# EAGLE design 1u_panel (EAGLE 7.7.0)
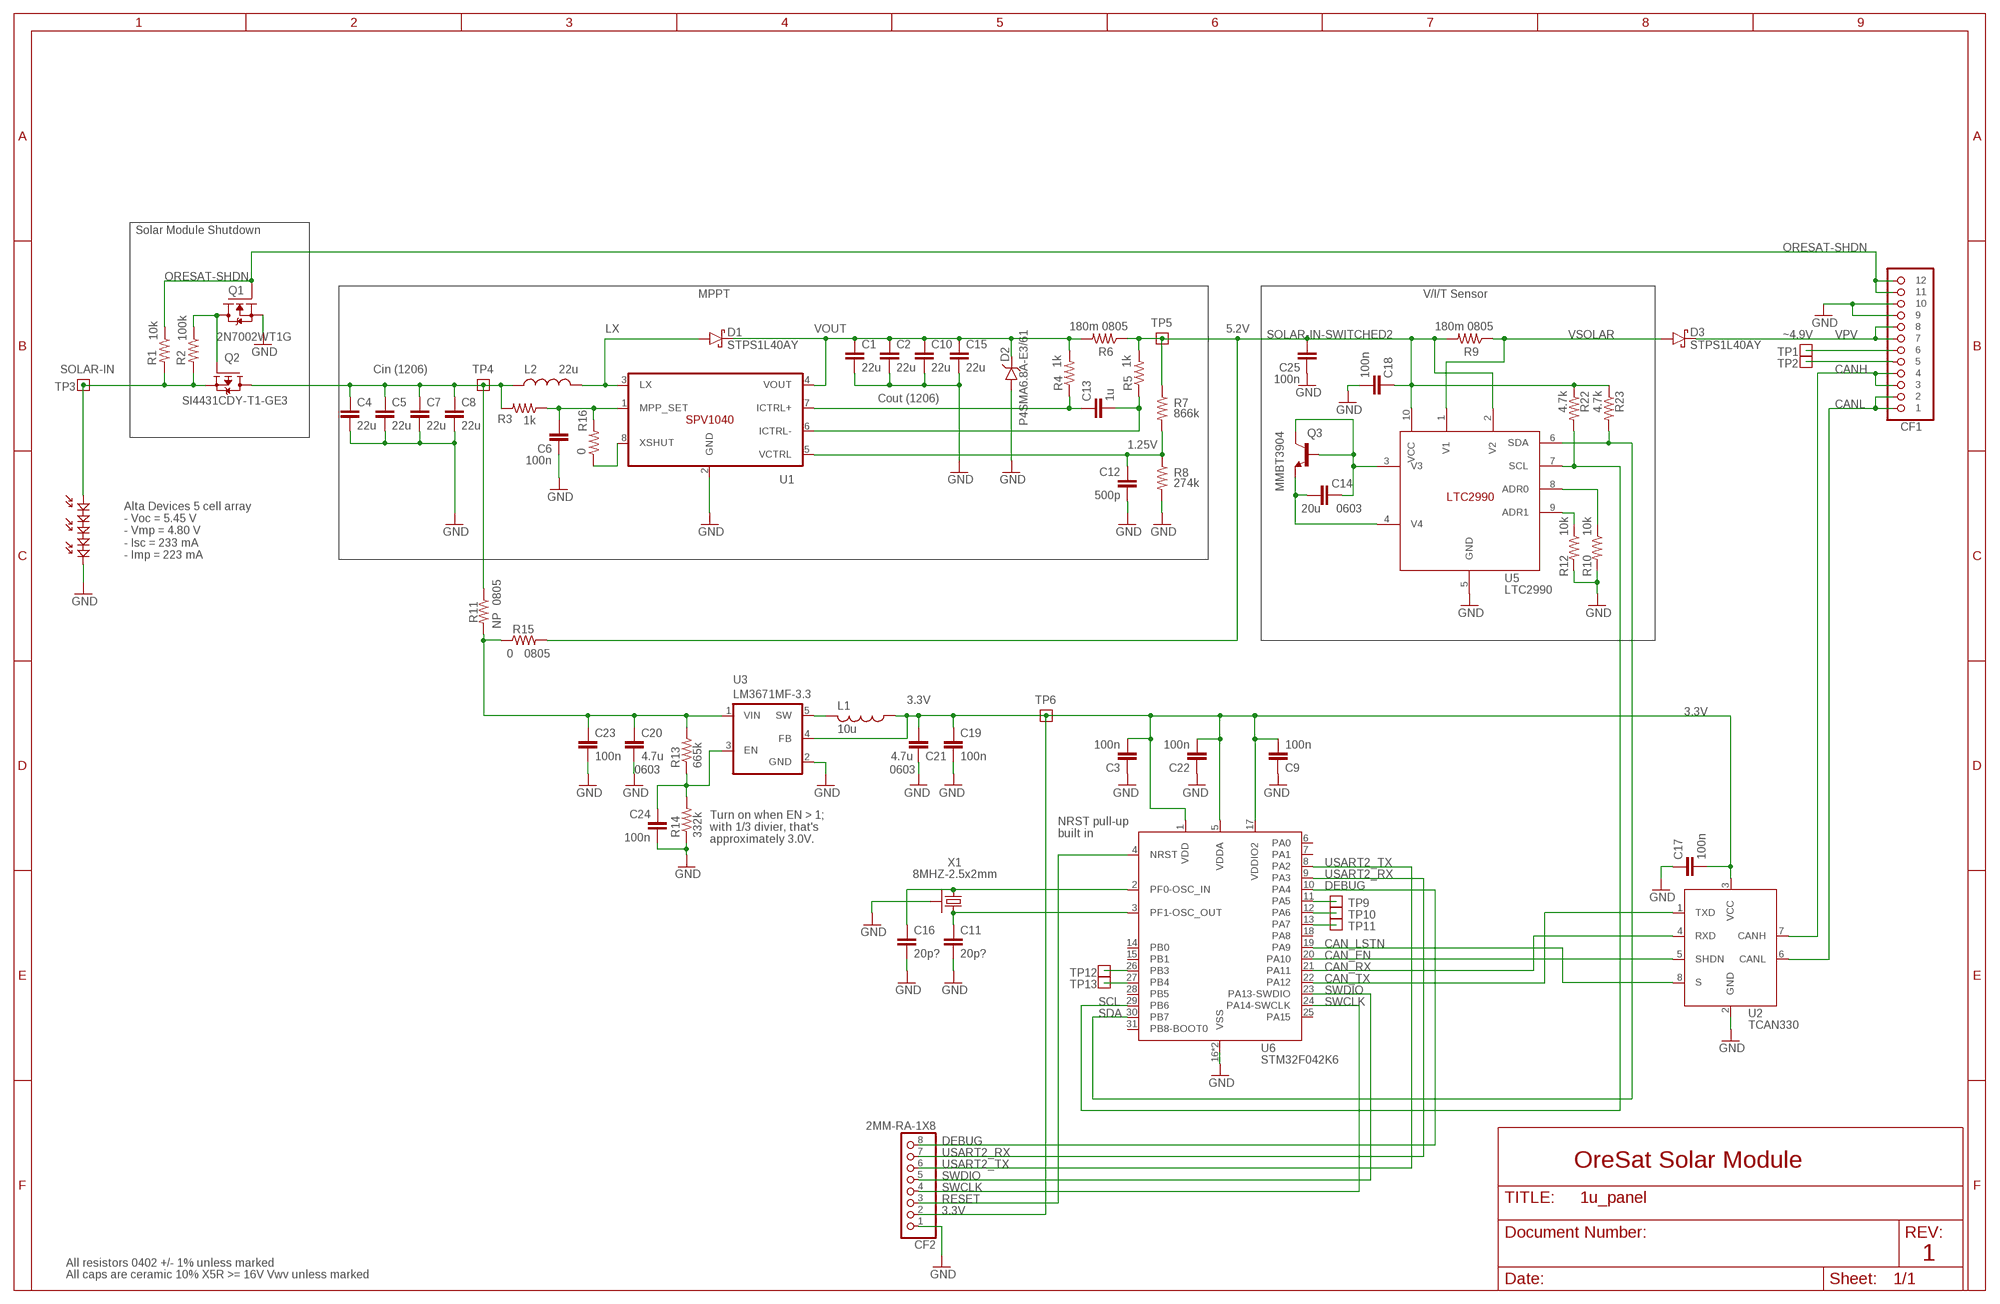
[diagram p0: schematic, sheet 1]

## Parts
C1  22u  C-EU1206-B  [1206-B]
C2  22u  C-EU1206-B  [1206-B]
C3  100n  C-EU0402-B-NOSILK  [.0402-B-NOSILK]
C4  22u  C-EU1206-B  [1206-B]
C5  22u  C-EU1206-B  [1206-B]
C6  100n  C-EU0402-B-NOSILK  [.0402-B-NOSILK]
C7  22u  C-EU1206-B  [1206-B]
C8  22u  C-EU1206-B  [1206-B]
C9  100n  C-EU0402-B-NOSILK  [.0402-B-NOSILK]
C10  22u  C-EU1206-B  [1206-B]
C11  20p?  C-EU0402-B-NOSILK  [.0402-B-NOSILK]
C12  500p  C-EU0402-B-NOSILK  [.0402-B-NOSILK]
C13  1u  C-EU0402-B-NOSILK  [.0402-B-NOSILK]
C14  20u  C-EU0603-B-NOSILK  [.0603-B-NOSILK]
C15  22u  C-EU1206-B  [1206-B]
C16  20p?  C-EU0402-B-NOSILK  [.0402-B-NOSILK]
C17  100n  C-EU0402-B-NOSILK  [.0402-B-NOSILK]
C18  100n  C-EU0402-B-NOSILK  [.0402-B-NOSILK]
C19  100n  C-EU0402-B-NOSILK  [.0402-B-NOSILK]
C20  4.7u  C-EUC0603  [C0603]
C21  4.7u  C-EUC0603  [C0603]
C22  100n  C-EU0402-B-NOSILK  [.0402-B-NOSILK]
C23  100n  C-EU0402-B-NOSILK  [.0402-B-NOSILK]
C24  100n  C-EU0402-B-NOSILK  [.0402-B-NOSILK]
C25  100n  C-EU0402-B-NOSILK  [.0402-B-NOSILK]
CF1  ORESAT-SOLARPANEL-12PIN  [CON-1.27-F-HARTING-1522012X601XXX]
CF2  2MM-RA-1X8  [CF-2MM-RA-1X8-PRECIDIP-831]
D1  STPS1L40AY  DIODE-DO214AC  [DO214AC]
D2  P4SMA6.8A-E3/61  DIODE-DO214AC  [DO214AC]
D3  STPS1L40AY  DIODE-DO214AC  [DO214AC]
L1  10u  L-USL2012C  [L2012C]
L2  22u  L-VISHAY-DALE-IFSC-1515AHER  [VISHAY-DALE-IFSR-1515AHER]
PV1  ALTA-5-CELL-ARRAYALTA-FIVE-CELL-SLOT  [ALTA-FIVE-CELL-THROUGH-SLOT]
Q1  2N7002WT1G  ON-N-CHANNEL-FET  [SOT23]
Q2  SI4431CDY-T1-GE3  P-CHANNELFET  [SO8]
Q3  MMBT3904  DIODE-INC-NPNSOT23HOLE  [SOT23HOLE]
R1  10k  R-US_0402-B-NOSILK  [.0402-B-NOSILK]
R2  100k  R-US_0402-B-NOSILK  [.0402-B-NOSILK]
R3  1k  R-US_0402-B-NOSILK  [.0402-B-NOSILK]
R4  1k  R-US_0402-B-NOSILK  [.0402-B-NOSILK]
R5  1k  R-US_0402-B-NOSILK  [.0402-B-NOSILK]
R6  180m 0805  R-US_0805-B-NOSILK  [.0805-B-NOSILK]
R7  866k  R-US_0402-B-NOSILK  [.0402-B-NOSILK]
R8  274k  R-US_0402-B-NOSILK  [.0402-B-NOSILK]
R9  180m 0805  R-US_0805-B-NOSILK  [.0805-B-NOSILK]
R10  10k  R-US_0402-B-NOSILK  [.0402-B-NOSILK]
R11  NP  R-US_0805-B-NOSILK  [.0805-B-NOSILK]
R12  10k  R-US_0402-B-NOSILK  [.0402-B-NOSILK]
R13  665k  R-US_0402-B-NOSILK  [.0402-B-NOSILK]
R14  332k  R-US_0402-B-NOSILK  [.0402-B-NOSILK]
R15  0  R-US_0805-B-NOSILK  [.0805-B-NOSILK]
R16  0  R-US_0402-B-NOSILK  [.0402-B-NOSILK]
R22  4.7k  R-US_0402-B-NOSILK  [.0402-B-NOSILK]
R23  4.7k  R-US_0402-B-NOSILK  [.0402-B-NOSILK]
TP1  TEST-POINT  [2MM-TEST-POINT]
TP2  TEST-POINT  [2MM-TEST-POINT]
TP3  TEST-POINT  [2MM-TEST-POINT]
TP4  TEST-POINT  [2MM-TEST-POINT]
TP5  TEST-POINT  [2MM-TEST-POINT]
TP6  TEST-POINT  [2MM-TEST-POINT]
TP9  TEST-POINT  [2MM-TEST-POINT]
TP10  TEST-POINT  [2MM-TEST-POINT]
TP11  TEST-POINT  [2MM-TEST-POINT]
TP12  TEST-POINT  [2MM-TEST-POINT]
TP13  TEST-POINT  [2MM-TEST-POINT]
U1  SPV1040  [TSSOP-8]
U2  TCAN330  [SOT23-8_TI-DCN]
U3  LM3671MF-3.3  LM3761  [SOT23-5]
U5  LTC2990  [MSOP10]
U6  STM32F042K6  [QFP32-7X7]
X1  8MHZ-2.5x2mm  CRYSTAL-WITH-GND  [CRYSTAL_2.5X2]

## Nets
3.3V: C3.2 C9.2 C17.2 C19.1 C21.1 C22.2 CF2.2 L1.1 TP6.1 U2.3(VCC) U3.4(FB) U6.1(VDD) U6.5(VDDA) U6.17(VDDIO2)
ADDRSELECT: R10.1 U5.8(ADR0)
ADR1: R12.1 U5.9(ADR1)
CAN_EN: U2.5(SHDN) U6.20(PA10)
CAN_LSTN: U2.8(S) U6.19(PA9)
CAN_RX: U2.4(RXD) U6.21(PA11)
CAN_TX: U2.1(TXD) U6.22(PA12)
CANH: CF1.3 CF1.4 U2.7(CANH)
CANL: CF1.1 CF1.2 U2.6(CANL)
CRYSTALIN: C16.1 U6.2(PF0-OSC_IN) X1.1
CRYSTALOUT: C11.1 U6.3(PF1-OSC_OUT) X1.3
DEBUG: CF2.8 U6.10(PA4)
GND: C1.2 C2.2 C3.1 C4.2 C5.2 C6.1 C7.2 C8.2 C9.1 C10.2 C11.2 C12.2 C15.2 C16.2 C17.1 C18.2 C19.2 C20.2 C21.2 C22.1 C23.2 C24.2 C25.1 CF1.9 CF1.10 CF2.1 D2.A PV1.NEG1(NEG) PV1.NEG2(NEG) Q1.2(S) R8.2 R10.2 R12.2 R14.1 U1.2(GND) U2.2(GND) U3.2(GND) U5.5(GND) U6.16(VSS) U6.32(VSS) X1.2(SHIELD) X1.4(SHIELD)
ICTRL+: C13.2 R4.1 U1.7(ICTRL+)
ICTRL-: C13.1 R5.1 U1.6(ICTRL-)
LX: D1.A L2.1 U1.3(LX)
MPP-SET: C6.2 R3.1 R16.2 U1.1(MPP_SET)
N6: Q1.3(D) Q2.4(G) R2.1
N$1: C20.1 C23.1 R11.2 R13.2 R15.1 U3.1(VIN)
N$3: CF1.6 TP1.1
N$4: CF1.5 TP2.1
N$6: TP9.1 U6.11(PA5)
N$7: TP10.1 U6.12(PA6)
N$8: TP11.1 U6.13(PA7)
N$9: TP12.1 U6.26(PB3)
N$10: TP13.1 U6.27(PB4)
ORESAT-SHDN: CF1.11 CF1.12 Q1.1(G) R1.1
RESET: CF2.3 U6.4(NRST)
SCL: R22.2 U5.7(SCL) U6.29(PB6)
SDA: R23.2 U5.6(SDA) U6.30(PB7)
SOLAR-IN: PV1.POS1(POS) PV1.POS2(POS) Q2.1(S) Q2.2(S) Q2.3(S) R1.2 R2.2 TP3.1
SOLAR-IN-SWITCHED: C4.1 C5.1 C7.1 C8.1 L2.2 Q2.5(D) Q2.6(D) Q2.7(D) Q2.8(D) R3.2 R11.1 TP4.1
SOLAR-IN-SWITCHED2: C18.1 C25.2 R5.2 R6.1 R7.1 R9.2 R15.2 R22.1 R23.1 TP5.1 U5.2(V2) U5.10(VCC)
STEPD: L1.2 U3.5(SW)
SWCLK: CF2.4 U6.24(PA14-SWCLK)
SWDIO: CF2.5 U6.23(PA13-SWDIO)
USART2_RX: CF2.7 U6.9(PA3)
USART2_TX: CF2.6 U6.8(PA2)
V3: C14.2 Q3.1(B) Q3.3(C) U5.3(V3)
V4: C14.1 Q3.2(E) U5.4(V4)
VCTRL: C12.1 R7.2 R8.1 U1.5(VCTRL)
VDIV: C24.1 R13.1 R14.2 U3.3(EN)
VOUT: C1.1 C2.1 C10.1 C15.1 D1.C D2.C R4.2 R6.2 U1.4(VOUT)
VPV: CF1.7 CF1.8 D3.C
VSOLAR: D3.A R9.1 U5.1(V1)
XSHUT: R16.1 U1.8(XSHUT)
Unconnected: U6.6(PA0) U6.7(PA1) U6.14(PB0) U6.15(PB1) U6.18(PA8) U6.25(PA15) U6.28(PB5) U6.31(PB8-BOOT0)

## Notes on the sheet
- Solar Module Shutdown
- MPPT | V/I/T Sensor
- 5.2V
- ~4.9V
- Cin (1206)
- Cout (1206)
- 1.25V
- 0603
- Alta Devices 5 cell array
  - Voc = 5.45 V
  - Vmp = 4.80 V
  - Isc = 233 mA
  - Imp = 223 mA
- 0805
- 0805
- 0603 | 0603
- NRST pull-up
  built in
- Turn on when EN > 1; 
  with 1/3 divier, that's
  approximately 3.0V.
- OreSat Solar Module
- 1
- All resistors 0402 +/- 1% unless marked
- All caps are ceramic 10% X5R >= 16V Vwv unless marked

## Library data of the parts
C1 C2 C4 C5 C7 C8 C10 C15 = rcl_custom:C-EU: CAPACITOR, European symbol; DIS: Digi-Key; DPN: 490-5309-1-ND; MFR: Murata; MPN: GRM31CR71A226KE15L
C3 C6 C9 C17-C19 C22-C25 = rcl_custom:C-EU: CAPACITOR, European symbol; DIS: Digi-key; DPN: 1276-1001-1-ND; MFR: Samsung Electro-Mechanics America, Inc.; MPN: CL05B104KO5NNNC
C11 C16 = rcl_custom:C-EU: CAPACITOR, European symbol
C12 = rcl_custom:C-EU: CAPACITOR, European symbol; DIS: Digi-key; DPN: 1276-1577-1-ND; MFR: Samsung Electro-Mechanics America, Inc.; MPN: CL05B561KB5NNNC
C13 = rcl_custom:C-EU: CAPACITOR, European symbol; DIS: Digi-key; DPN: 1276-1445-1-ND; MFR: Samsung Electro-Mechanics America, Inc.; MPN: CL05A105KA5NQNC
C14 = rcl_custom:C-EU: CAPACITOR, European symbol; DIS: Digi-key; DPN: 1276-1274-1-ND; MFR: Samsung Electro-Mechanics America, Inc.; MPN: CL10A226MP8NUNE
C20 C21 = rcl:C-EU: CAPACITOR, European symbol; DIS: Digi-key; DPN: 1276-1001-1-ND; MFR: Samsung Electro-Mechanics America, Inc.; MPN: CL05B104KO5NNNC
CF1 = oresat-eagle:ORESAT-SOLARPANEL-12PIN
CF2 = 2mm-RA-solar-module-debugging:2MM-RA-1X8; DIST: Digi-Key; DPN: 1212-1893-ND; MFN: PreciDip; MPN: 831-87-050-40-001101
D1 D3 = diode-schottkey:DIODE-: DIODE; DIST: Digi-Key; DPN: 497-12286-1-ND; MFR: ST; MPN: STPS1L40AY
D2 = diode-zener-tvs:DIODE-: DIODE; DIST: Digi-Key; DPN: P4SMA6.8A-E3/61GICT-ND; MFR: Vishay; MPN: P4SMA6.8A-E3/61
L1 = rcl:L-US: INDUCTOR, American symbol; DIS: Digi-key; DPN: 587-2452-1-ND; MFR: Taiyo Yuden; MPN: CB2012T100KR
L2 = ind-vishay-dale-IFSC-1515AHER:L-VISHAY-DALE-IFSC-1515AHER; DIS: Digi-Key; DPN: 541-1407-1-ND; MFR: Vishay Dale; MPN: IFSC1515AHER220M01
PV1 = alta-cell:ALTA-5-CELL-ARRAY
Q1 = on-n-channel-fet:ON-N-CHANNEL-FET; DIS: Digi-Key; DPN: 2N7002WT1GOSCT-ND; MFR: rer ON Semiconductor; MPN: 2N7002WT1G
Q2 = vishay-p-channel-fet:P-CHANNELFET; DIS: Digi-key; DPN: SI4431CDY-T1-GE3CT-ND; MFR: Vishay Siliconix; MPN: SI4431CDY-T1-GE3
Q3 = diodes-inc-npn:DIODE-INC-NPN; DIS: Digi-Key; DPN: MMBT3904FSCT-ND; MFR: Fairchild/ON Semiconductor; MPN: MMBT3904
R1 = rcl_custom:R-US_: RESISTOR, American symbol; DIS: Digi-Key; DPN: RHM10.0KLCT-ND; MFR: Rohm Semiconductor; MPN: MCR01MZPF1002
R2 = rcl_custom:R-US_: RESISTOR, American symbol; DIS: Digi-key; DPN: RHM100KCDCT-ND; MFR: Rohm Semiconductor; MPN: MCR01MRTF1003
R3 = rcl_custom:R-US_: RESISTOR, American symbol; DIS: Digi-key; DPN: RHM1.00KLCT-ND; MFN: Rohm Semiconductor; MPN: MCR01MZPF1001
R4 R5 R11 R15 R16 = rcl_custom:R-US_: RESISTOR, American symbol
R6 R9 = rcl_custom:R-US_: RESISTOR, American symbol; DIST: Digi-Key; DPN: 541-2730-1-ND; MFR: Vishay Dale; MPN: RCWE0805R180FKEA
R7 = rcl_custom:R-US_: RESISTOR, American symbol; DIS: Digi-key; DPN: 1276-4285-1-ND; MFN: Samsung Electro-Mechanics America, Inc.; MPN: RC1005F8663CS
R8 = rcl_custom:R-US_: RESISTOR, American symbol; DIS: Digi-key; DPN: 541-274KLCT-ND; MFR: Vishay Dale; MPN: CRCW0402274KFKED
R10 R12 = rcl_custom:R-US_: RESISTOR, American symbol; DIS: Digi-key; DPN: RHM10.0KLCT-ND; MFR: Rohm Semiconductor; MPN: MCR01MZPF1002
R13 = rcl_custom:R-US_: RESISTOR, American symbol; DIS: Digi-key; DPN: 1276-4275-1-ND; MFR: Samsung Electro-Mechanics America, Inc.; MPN: RC1005F6653CS
R14 = rcl_custom:R-US_: RESISTOR, American symbol; DIS: Digi-key; DPN: 1276-4245-1-ND; MFR: Samsung Electro-Mechanics America, Inc.; MPN: RC1005F3323CS
R22 R23 = rcl_custom:R-US_: RESISTOR, American symbol; DIS: Digi-key; DPN: RHM4.7KBHCT-ND; MFR: Rohm Semiconductor; MPN: TRR01MZPF4701
TP1-TP6 TP9-TP13 = Tova:TEST-POINT
U1 = spv1040:SPV1040; DIS: Digi-key; DPN: 497-11417-ND; MFR: STMicroelectronics; MPN: SPV1040T
U2 = TCAN330:TCAN330; DIS: Digi-key; DPN: 296-44211-1-ND; MFR: Texas Instruments; MPN: TCAN330GDCNT
U3 = LM3761:LM3761: http://www.digikey.com/product-detail/en/texas-instruments/LM3671MF-3.3-NOPB/LM3671MF-3.3-NOPBCT-ND/1590190
U5 = LTC2990:LTC2990; DIS: Digi-Key; DPN: LTC2990CMS#PBF-ND; MFR: Linear Technology; MPN: LTC2990CMS#PBF
U6 = STM32F042K:STM32F042K6; DIS: Digi-key; DPN: 497-14647-ND; MFR: STMicroelectronics; MPN: STM32F042K6T6
X1 = low-gain-radio:CRYSTAL-WITH-GND; DIS: Digi-key; DPN: XC2015CT-ND; MFR: ECS Inc.; MPN: ECS-80-18-20BQ-DS

## Board
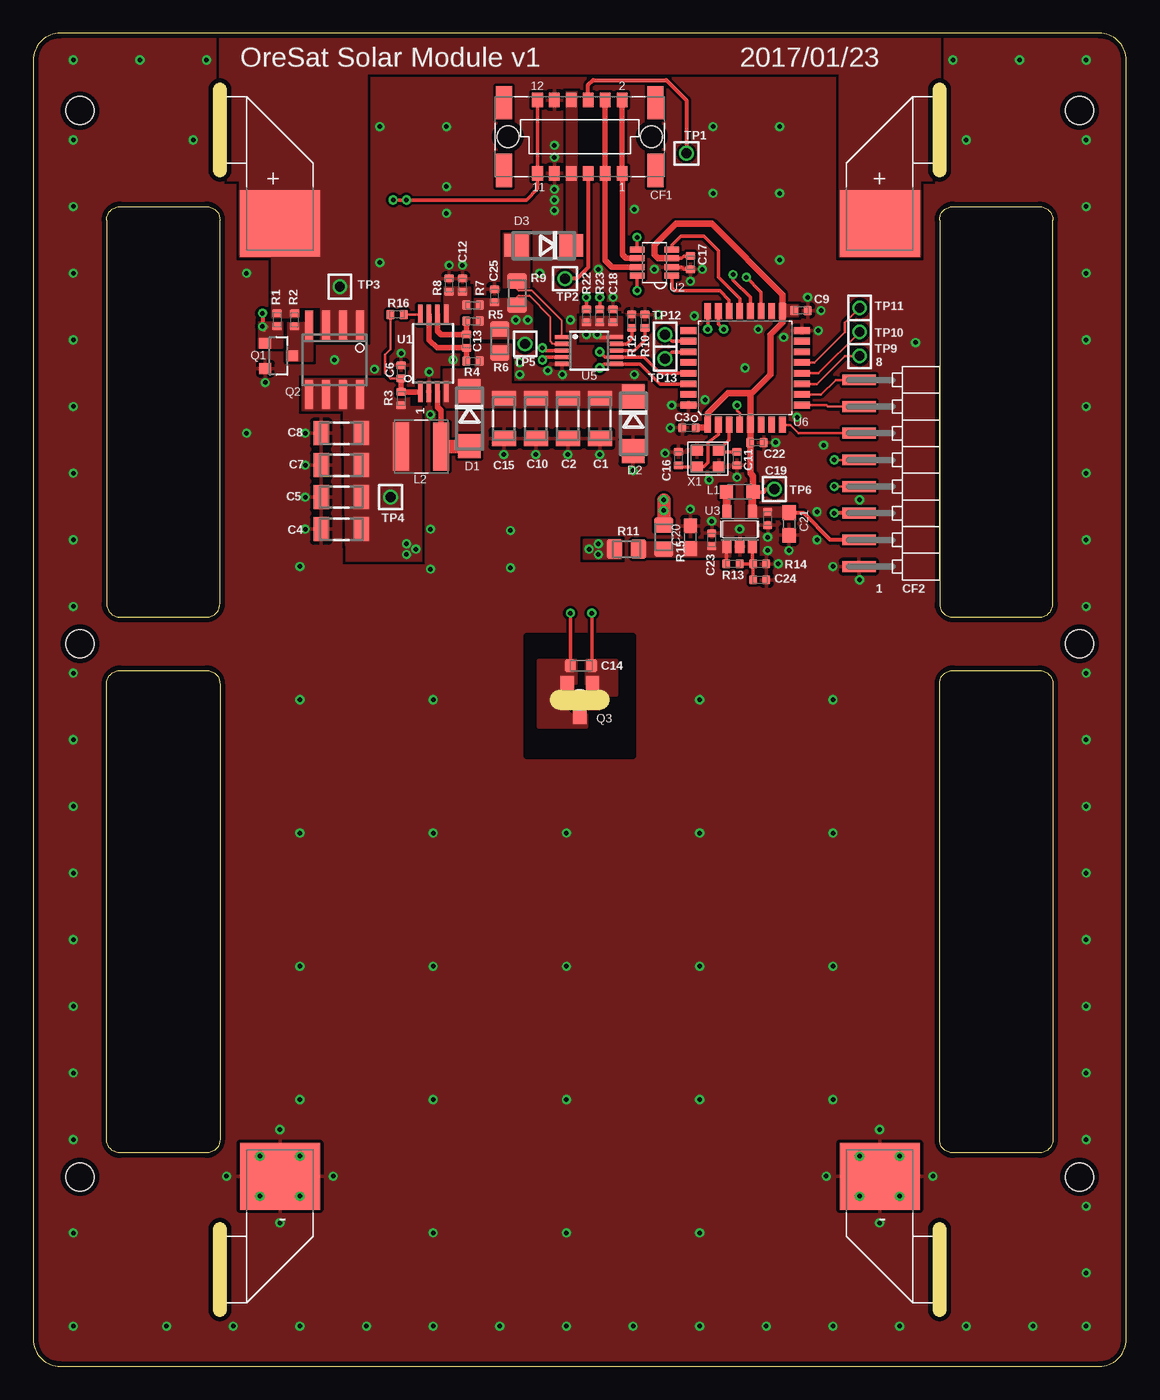
[diagram p1: board, top side]
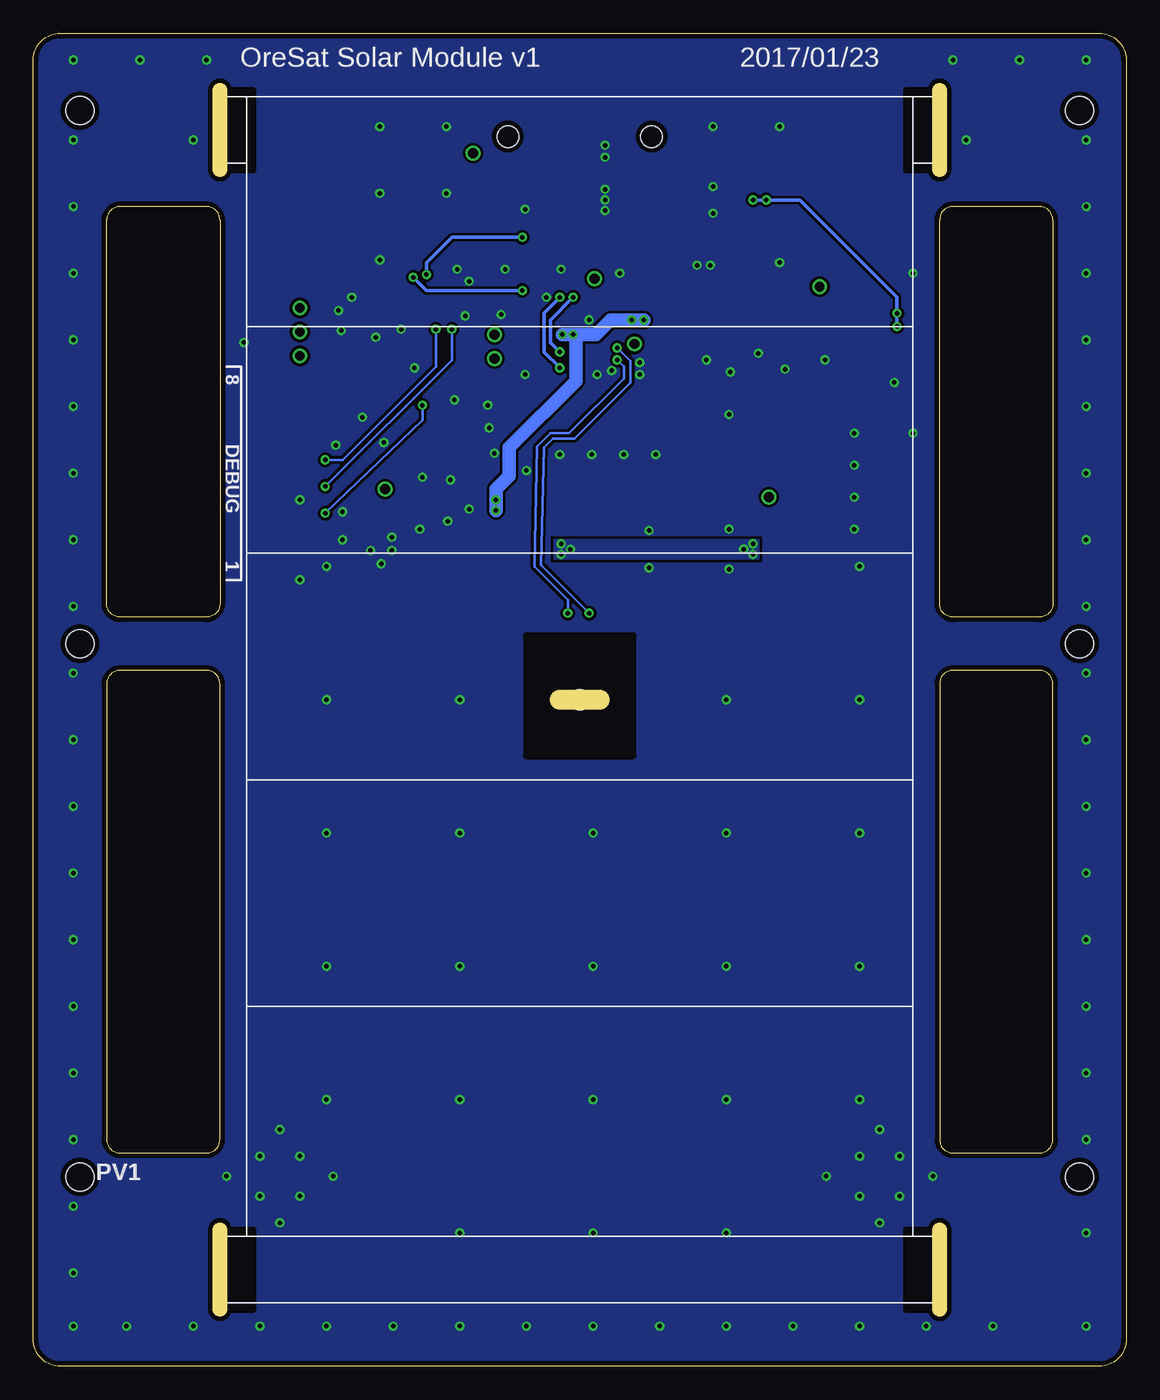
[diagram p2: board, bottom side, seen from below]

Size 82 x 100 mm. Coordinates in mm from the lower left corner, seen from the top.
Outline: 80,100 2,100 arc90 0,98 0,2 arc90 2,0 80,0 arc90 82,2 82,98 arc90 80,100
Outline: 6.5,56.2 13,56.2 arc90 14,57.2 14,86 arc90 13,87 6.5,87 arc90 5.5,86 5.5,57.2 arc90 6.5,56.2
Outline: 5.5,17 5.5,51.2 arc-90 6.5,52.2 13,52.2 arc-90 14,51.2 14,17 arc-90 13,16 6.5,16 arc-90 5.5,17
Outline: 69,56.2 75.5,56.2 arc90 76.5,57.2 76.5,86 arc90 75.5,87 69,87 arc90 68,86 68,57.2 arc90 69,56.2
Outline: 68,17 68,51.2 arc-90 69,52.2 75.5,52.2 arc-90 76.5,51.2 76.5,17 arc-90 75.5,16 69,16 arc-90 68,17
Outline: 68,89.25 arc90 68.5,89.75 68.5,95.75 arc90 68,96.25 arc90 67.5,95.75 67.5,89.75 arc90 68,89.25
Outline: 14.5,89.75 14.5,95.75 arc90 14,96.25 arc90 13.5,95.75 13.5,89.75 arc90 14,89.25 arc90 14.5,89.75
Outline: 14.5,4.25 14.5,10.25 arc90 14,10.75 arc90 13.5,10.25 13.5,4.25 arc90 14,3.75 arc90 14.5,4.25
Outline: 68.5,4.25 68.5,10.25 arc90 68,10.75 arc90 67.5,10.25 67.5,4.25 arc90 68,3.75 arc90 68.5,4.25
Copper layers (1*16): Top 0.0356mm / dielectric 1.5011mm / Bottom 0.0356mm
Design rules "OSH-Park-2-layer *": minimum track width 6mil, minimum drill 13mil, track to track 6mil, track to pad 6mil, pad to pad 6mil, via to via 6mil, smd to smd 6mil, copper to edge 15mil, drill to drill 6mil, minimum pad ring 7mil, minimum via ring 7mil, stop-mask expansion 3mil, vias tented up to drill 13mil, thermal gap 10mil
Holes 2.1 mm at 3.5,14.2 3.5,54.2 3.5,94.2 78.5,14.2 78.5,54.2 78.5,94.2
tKeepout: area 0,0 to 82,100
tRestrict: 6 lines
bRestrict: 4 lines
Milling: 1 lines

### Footprints (pad centres in the part's own frame; a part is rotated, then mirrored left to right if it is on the bottom)
1206-B = smd 1.15 x 1.8: 1 -1.5,0; 2 1.5,0
.0402-B-NOSILK = smd 0.6 x 0.7: 1 -0.5,0; 2 0.5,0
.0603-B-NOSILK = smd 0.8 x 0.95: 1 -0.8,0; 2 0.8,0
C0603 = smd 1.1 x 1: 1 -0.85,0; 2 0.85,0
CON-1.27-F-HARTING-1522012X601XXX = smd 0.8 x 1.1: 1 3.175,-2.75; 2 3.175,2.75; 3 1.905,-2.75; 4 1.905,2.75; 5 0.635,-2.75; 6 0.635,2.75; 7 -0.635,-2.75; 8 -0.635,2.75; 9 -1.905,-2.75; 10 -1.905,2.75; 11 -3.175,-2.75; 12 -3.175,2.75 | smd 1.2 x 2.5: P$1 -5.685,-2.55; P$2 -5.685,2.55; P$3 5.685,2.55; P$4 5.685,-2.55 | hole 1.6: -5.385,0; 5.385,0
CF-2MM-RA-1X8-PRECIDIP-831 = smd 2.5 x 0.8: 1 -3.25,-7; 2 -3.25,-5; 3 -3.25,-3; 4 -3.25,-1; 5 -3.25,1; 6 -3.25,3; 7 -3.25,5; 8 -3.25,7
DO214AC = smd 1.8 x 1.7: A 2.05,0; C -2.05,0
L2012C = smd 1 x 1: 1 -1,0; 2 1,0
VISHAY-DALE-IFSR-1515AHER = smd 3.6 x 1.2: 1 0,1.5; 2 0,-1.5
ALTA-FIVE-CELL-THROUGH-SLOT = smd 6 x 5 bottom: NEG1 -22.5,35.75; NEG2 22.5,35.75; POS1 -22.5,-35.75; POS2 22.5,-35.75
SOT23 = smd 0.8 x 0.9: 1 -0.95,-1; 2 0.95,-1; 3 0,1
SO8 = smd 0.6 x 2.2: 1 -1.905,-2.6; 2 -0.635,-2.6; 3 0.635,-2.6; 4 1.905,-2.6; 5 1.905,2.6; 6 0.635,2.6; 7 -0.635,2.6; 8 -1.905,2.6
SOT23HOLE = smd 1 x 1.4: 1 0.95,-1.1; 2 -0.95,-1.1; 3 0,1.1 | hole 1.5: 0,0
.0805-B-NOSILK = smd 1.15 x 1.45: 1 -0.9,0; 2 0.9,0
2MM-TEST-POINT = drill 0.737: 1 0,0
TSSOP-8 = smd 1.56 x 0.41: 1 -2.88,0.975; 2 -2.88,0.325; 3 -2.88,-0.325; 4 -2.88,-0.975; 5 2.88,-0.975; 6 2.88,-0.325; 7 2.88,0.325; 8 2.88,0.975
SOT23-8_TI-DCN = smd 0.45 x 1.1: 1 -0.975,-1.3; 2 -0.325,-1.3; 3 0.325,-1.3; 4 0.975,-1.3; 5 0.975,1.3; 6 0.325,1.3; 7 -0.325,1.3; 8 -0.975,1.3
SOT23-5 = smd 0.69 x 0.99: 1 -0.95,-1.29; 2 0,-1.29; 3 0.95,-1.29; 4 0.95,1.3; 5 -0.95,1.3
MSOP10 = smd 0.3 x 1: 1 -1,-2.05; 2 -0.5,-2.05; 3 0,-2.05; 4 0.5,-2.05; 5 1,-2.05; 6 1,2.05; 7 0.5,2.05; 8 0,2.05; 9 -0.5,2.05; 10 -1,2.05
QFP32-7X7 = smd 1.2 x 0.5: 1 -4.25,2.8; 2 -4.25,2; 3 -4.25,1.2; 4 -4.25,0.4; 5 -4.25,-0.4; 6 -4.25,-1.2; 7 -4.25,-2; 8 -4.25,-2.8; 17 4.25,-2.8; 18 4.25,-2; 19 4.25,-1.2; 20 4.25,-0.4; 21 4.25,0.4; 22 4.25,1.2; 23 4.25,2; 24 4.25,2.8 | smd 0.5 x 1.2: 9 -2.8,-4.25; 10 -2,-4.25; 11 -1.2,-4.25; 12 -0.4,-4.25; 13 0.4,-4.25; 14 1.2,-4.25; 15 2,-4.25; 16 2.8,-4.25; 25 2.8,4.25; 26 2,4.25; 27 1.2,4.25; 28 0.4,4.25; 29 -0.4,4.25; 30 -1.2,4.25; 31 -2,4.25; 32 -2.8,4.25
CRYSTAL_2.5X2 = smd 0.9 x 0.8: 1 -0.825,-0.625; 2 0.825,-0.625; 3 0.825,0.625; 4 -0.825,0.625

### Placement (x,y rotation side)
C1  42.5,71.1 270 top
C2  40.1,71.1 270 top
C3  49.2,70.4 0 top
C4  23.1,62.8 180 top
C5  23.1,65.2 180 top
C6  27.6,74.6 270 top
C7  23.1,67.6 180 top
C8  23.1,70 180 top
C9  57.6,79.2 180 top
C10  37.7,71.1 270 top
C11  52.8,68.1 270 top
C12  32.2,81.1 90 top
C13  32.5,76.9 270 top
C14  41.1,52.55 180 top
C15  35.3,71.1 270 top
C16  48.4,68.1 90 top
C17  49.3,82.8 90 top
C18  43.5,78.8 90 top
C19  55.1,63.6 270 top
C20  49.3,62.2 90 top
C21  56.7,63.2 270 top
C22  54.3,69.3 180 top
C23  50.9,62 90 top
C24  54.5,59 0 top
C25  34.6,80.3 270 top
CF1  41,92.25 0 top
CF2  65.2,67 0 top
D1  32.7,71.1 270 top
D2  45,70.7 270 top
D3  38.3,84.1 180 top
L1  53,65.6 180 top
L2  29.1,69 270 top
PV1  41,50 180 bottom
Q1  18.4,75.8 270 top
Q2  22.6,75.5 180 top
Q3  41,50 180 top
R1  18.3,78.5 90 top
R2  19.6,78.5 90 top
R3  27.6,72.6 270 top
R4  33,75.4 0 top
R5  33,78.4 0 top
R6  35,76.9 270 top
R7  33,79.6 180 top
R8  31.2,81.1 90 top
R9  36.3,80.5 270 top
R10  45.9,78.4 90 top
R11  44.5,61.3 0 top
R12  44.9,78.4 90 top
R13  52.5,60.2 180 top
R14  54.5,60.2 180 top
R15  47.3,62.2 90 top
R16  27.3,78.9 180 top
R22  41.5,78.8 90 top
R23  42.5,78.8 90 top
TP1  49,91 90 top
TP2  39.9,81.6 90 top
TP3  23,81 0 top
TP4  26.8,65.2 0 top
TP5  36.9,76.7 0 top
TP6  55.6,65.8 0 top
TP9  62,75.8 0 top
TP10  62,77.6 0 top
TP11  62,79.4 0 top
TP12  47.4,77.4 0 top
TP13  47.4,75.6 0 top
U1  30,76 90 top
U2  46.6,82.8 90 top
U3  53,62.8 0 top
U5  41.71,76.2 270 top
U6  53.4,74.9 90 top
X1  50.6,68.1 0 top

### Tracks (layer width: path | path; a pad name or v marks a point on that pad's centre or on a via)
3.3V
  Top 0.254: U2.3 48.62,83.12 48.8,83.3 C17.2
  Top 0.3: CF2.2 59.8,62 57.8,64 56.75,64 C21.1 | L1.1 54.8,65.6 55,65.8 TP6.1
  Top 0.5: U2.3 46.88,83.12 46.6,83.4 46.6,84.1 48.2,85.7 50.9,85.7 56.2,80.4 U6.17 56.2,78.3 55.3,77.4 55.3,74.4 53.9,73 53.8,73 | 53.8,73 52.1,73 50.6,71.5 U6.1 50.6,70.4 C3.2 | 53.8,73 U6.5 C22.2 53.8,67 54,66.8 L1.1
  Top 0.6: U3.4 53.95,65.45 L1.1
  pour Top (isolate 0.25, no thermals): 57.05,63.7 53.7,63.7 53.7,64.45 57.05,64.45
  pour Top (no thermals): 56.1,79.6 56.1,78.8 57.4,78.8 57.4,79.6
ADDRSELECT
  Top 0.25: R10.1 45.9,77 45.1,76.2 U5.8
ADR1
  Top 0.25: R12.1 44.9,77.1 44.5,76.7 U5.9
CAN_EN  (via drill 0.33)
  Top 0.25: v52.5,81.9 52.5,81.5 53.8,80.2 U6.20 | U2.5 v45.3,84.7
  Bottom 0.25: v52.5,81.9 52.5,82.8 50.6,84.7 v45.3,84.7
CAN_LSTN  (via drill 0.33)
  Top 0.25: v45.3,80.7 U2.8 | v53.5,81.7 54.6,80.6 U6.19
  Bottom 0.25: v53.5,81.7 52.5,80.7 v45.3,80.7
CAN_RX
  Top 0.25: U2.4 47.9,84.1 48.6,84.8 50.3,84.8 51.4,83.7 51.4,81.7 53,80.1 U6.21
CAN_TX
  Top 0.25: U2.1 47.9,80.9 48.1,80.7 51.5,80.7 52.2,80 U6.22
CANH
  Top 0.4: U2.7 43.42,82.47 42.9,83 42.91,83 CF1.3
  Top 0.406: CF1.3 CF1.4
CANL
  Top 0.4: U2.6 44.48,83.12 44.2,83.4 44.2,89.47
  Top 0.406: 44.2,89.47 CF1.1 CF1.2
CRYSTALIN
  Top 0.25: C16.1 48.52,67.47 X1.1 49.8,67.5 50.3,67.5 50.6,67.8 50.6,69.3 51.4,69.9 U6.2
CRYSTALOUT
  Top 0.25: U6.3 52.2,69.5 X1.3 51.55,68.6 C11.1
DEBUG
  Top 0.2: U6.10 59.1,72.9 60.2,74 CF2.8
GND  (via drill 0.33)
  Top 0.254: U2.2 48.62,82.47 48.8,82.3 C17.1
  other vias: 49.3,81.4 16,70 20,60 20,50 20,40 20,30 20,20 22.5,14.25 50,10 40,10 30,10 60,20 60,30 60,40 55.1,61.2 55.9,60.2 60,50 35.8,59.9 30,50 30,40 40,40 50,40 50,50 50,30 40,30 30,30 30,20 40,20 50,20 55.7,69.3 20,3 15,3 10,3 3,3 3,10 3,17 3,22 3,27 3,32 3,37 3,42 3,47 3,52 3,57 3,62 3,67 3,72 3,77 3,82 3,87 3,92 3,98 8,98 69,98 79,98 79,92 79,87 79,82 79,77 79,72 79,67 79,62 79,57 79,52 79,47 79,42 79,37 79,32 79,27 79,22 79,17 79,12 79,7 25,3 30,3 35,3 40,3 45,3 50,3 55,3 60,3 65,3 70,3 75,3 79,3 29.7,74.6 50.2,82.3 46.6,82.3 47.9,72.1 47.8,70.4 47.4,68.5 52.8,66.7 50.7,66.5 56.7,61.2 55.1,62.2 53,62.8 50.9,63.4 49.3,64.3 58.9,77.7 59.1,79.2 58.1,80.2 29.8,71.4 29.8,62.8 27.6,76 25.6,74.8 22.6,75.5 26,82.8 31.2,82.6 32.2,82.6 39.7,74.4 38.6,74.7 42.5,68.4 40.1,68.4 37.7,68.4 35.3,68.4 20.4,70 20.4,67.6 20.4,65.2 20.4,62.8 43.5,80.2 53.4,74.9 50.4,72.5 54.4,77.8 56.3,77.2 57.3,71.2 49.6,78.8 39.1,87.5 39.1,90.7 40.3,78.5 46.9,78.9 31.5,75.5 39.1,91.6 39.1,86.7 42.4,82.3 60,60 62,59 59.3,69.1 62,65 58.8,64.1 58.8,62 66.2,76.8 31,93 26,93 51,93 56,93 56,83 70,92 45,67.2 45.1,74.4 39.1,88.3 45.1,86.8 38,82 31,86.5 31,88.5 17.4,73.8 35.8,62.7 56,88 51,88 18.5,17.75 14.5,14.25 18.5,10.75 63.5,17.75 67.5,14.25 63.5,10.75 59.5,14.25 17,12.75 20,12.75 20,15.75 17,15.75 62,12.75 62,15.75 65,15.75 65,12.75 12,92 13,98 74,98 29.8,59.8 36.5,74.4 36.5,75.3 16,82
  pour Bottom (isolate 0.2, rank 6): 80,0 2,0 arc-90 0,2 0,98 arc-90 2,100 80,100 arc-90 82,98 82,2 arc-90
  pour Top (isolate 0.2, rank 6): 80,0 2,0 arc-90 0,2 0,98 arc-90 2,100 80,100 arc-90 82,98 82,2 arc-90
ICTRL+
  Top 0.406: U1.7 29.68,77 29.7,77 30.3,76.4 C13.2 R4.1
ICTRL-
  Top 0.406: R5.1 C13.1 30.6,77.4 30.32,77.67 U1.6
LX
  Top 0.4: U1.3 30.32,71.97 30.6,71.7 L2.1
  Top 1: L2.1 32.65,69 D1.A
MPP-SET
  Top 0.2: C6.2 26.8,74.1 26.4,74.5 26.4,75.9 26.8,76.3 R16.2
  Top 0.4: U1.1 29,73.1 R3.1 C6.2
N6
  pour Top (isolate 0.2, no thermals): 19.1,75.4 19.1,78.3 20.9,78.3 20.9,75.4
N$1
  Top 0.25: R13.2 52,61.46
  Top 0.5: 52,61.46 U3.1
  pour Top (isolate 0.2, no thermals): 52.25,60.7 45.1,60.7 45.1,61.85 52.25,61.85
N$3
  Top 0.3: CF1.6 41.63,96.14 42,96.5 47.5,96.5 49,95 TP1.1
N$4
  Top 0.3: CF1.5 41.63,82.44 40.8,81.6 TP2.1
N$6
  Top 0.2: U6.11 58.8,73.7 60.9,75.8 TP9.1
N$7
  Top 0.2: U6.12 58.9,74.5 TP10.1
N$8
  Top 0.2: U6.13 58.6,75.3 60.9,77.6 60.9,78.3 TP11.1
N$9
  Top 0.25: U6.26 47.9,76.9 TP12.1
N$10
  Top 0.25: U6.27 47.9,76.1 TP13.1
ORESAT-SHDN  (via drill 0.33)
  Top 0.2: 17.5,77.9 17.3,77.7
  Top 0.25: CF1.12 CF1.11 37.83,88.33 37,87.5 v27,87.5 | v17.2,78 17.5,78
  Top 0.3: v17.2,79 v17.2,78
  Bottom 0.25: v17.2,78 v17.2,79 17.2,80.2 24.5,87.5 v27,87.5 v28,87.5
  pour Top (isolate 0.2, no thermals): 16.9,76.4 18.7,76.4 18.7,78.3 16.9,78.3
RESET  (via drill 0.33)
  Top 0.2: U6.4 53,71.5 52.8,71.7 v52.8,72.1
  Top 0.3: CF2.3 v60.1,64
  Bottom 0.2: v52.8,72.1 52.8,71 v60.1,64
SCL  (via drill 0.33, 0.33 pad 0.25)
  Top 0.25: v41.5,80.2 41.5,79.5 | v42.5,76.1 42.9,75.7 U5.7 45.8,75.7 47,74.5 U6.29
  Top 0.406: 41.5,79.5 R22.2
  Bottom 0.25: v42.5,76.1 43.2,76.8 43.2,78.5 v41.5,80.2
SDA  (via drill 0.33)
  Top 0.25: v42.5,80.2 42.5,79.5 | v42.5,74.9 42.8,75.2 U5.6 45.5,75.2 47,73.7 U6.30
  Top 0.406: 42.5,79.5 R23.2
  Bottom 0.25: v42.5,74.9 43.7,76.1 43.7,79 v42.5,80.2
SOLAR-IN
  pour Top (isolate 0.2, no thermals): 68,100 14,100 14,89 15.5,89 15.5,83.25 17.9,83.25 17.9,78.7 19.9,78.7 19.9,79.5 21.6,79.5 21.6,76.9 25,76.9 25,97 60.5,97 60.5,83.25 66.5,83.25 66.5,89 68,89
SOLAR-IN-SWITCHED  (via drill 0.33)
  other vias: 42.4,61.7 42.4,60.9 41.7,61.3 28.7,61.3 28,61.7 28,60.9
  pour Top (isolate 0.2, no thermals): 23.5,60.4 23.3,71.7 20.2,71.7 20.2,74.1 28.2,74.1 28.2,72 29.1,72 29.1,60.4
  pour Top (no thermals): 44.1,60.6 44.1,62 41.3,62 41.3,60.6
  pour Bottom: 42.9,60.6 42.9,62 27.6,62 27.6,60.6
SOLAR-IN-SWITCHED2  (via drill 0.33)
  Top 0.152: U5.2 39,76.7 38.8,76.9 38.8,78.7 37.23,80.33 36.42,80.33 36.3,80.2 R9.2
  Top 0.3: 42.5,77.2 U5.10
  Top 1: R15.2 v47.3,64.2 v47.3,65
  Bottom 1: v36.2,78.5 v37.1,78.5 38.7,78.5 39.8,77.4 41.3,77.4 | v42.3,77.4 41.3,77.4 | 41.3,77.4 41.3,73.9 46.3,68.9 46.3,66.8 47.3,65.8 v47.3,65 v47.3,64.2
  other vias: 41.5,77.4
  pour Top (isolate 0.2, rank 2, no thermals): 37.4,77.1 33,77.1 33,80.1 36.9,80.1 37.4,79.6
  pour Top (isolate 0.2, no thermals): 41,76.9 44.2,76.9 44.2,78.7 41,78.7
STEPD
  Top 0.6: U3.5 52.05,65.45 L1.2
SWCLK  (via drill 0.33)
  Top 0.2: CF2.4 v60.1,66
  Top 0.25: U6.24 v50.6,77.8
  Bottom 0.2: v60.1,66 50.6,75.5 v50.6,77.8
SWDIO  (via drill 0.33)
  Top 0.2: CF2.5 v60.1,68
  Top 0.25: U6.23 51.4,78.2 v51.8,77.8
  Bottom 0.2: v51.8,77.8 51.8,75 58.8,68 v60.1,68
USART2_RX
  Top 0.2: U6.9 59.5,72.1 59.6,72 CF2.7
USART2_TX
  Top 0.2: CF2.6 57.4,70 56.8,70.6 56.25,70.6 U6.8
V3  (via drill 0.33 pad 0.5)
  Top 0.25: C14.2 v40.3,56.5 | U5.3 38.4,76.2 v38.2,76.4
  Bottom 0.2: v40.3,56.5 43.9,60.1 43.7,68.9 43,69.6 41.4,69.6 37.2,73.8 37.2,75.4 v38.2,76.4
  pour Top (no thermals): 41.5,47.95 41.5,49.5 40.7,49.5 40.7,52.95 37.9,52.95 37.9,47.95
V4  (via drill 0.33 pad 0.5)
  Top 0.25: C14.1 v41.9,56.5 | U5.4 38.4,75.7 v38.2,75.5
  Bottom 0.2: v41.9,56.5 41.9,57.5 44.4,60 44.2,69 43.2,70 41.8,70 37.7,74.1 37.7,75 v38.2,75.5
  pour Top (no thermals): 41.5,52.95 41.5,50.35 43.75,50.35 43.75,52.95
VCTRL
  pour Top (isolate 0.2, no thermals): 32.8,80.9 30.8,80.9 30.8,78.2 32.8,78.2
VDIV
  Top 0.25: U3.3 53.95,60.2 | 53.95,60.2 R13.1 | 53.95,60.2 R14.2 C24.1
VOUT
  pour Top (isolate 0.2, no thermals): 45.8,71.9 30.8,71.9 30.8,74.8 33.2,74.8 33.2,76.7 35.8,76.7 35.8,73.7 45.8,73.7
VPV
  pour Top (isolate 0.2, no thermals): 40,83.9 40.8,83.9 40.8,95.6 40,95.6
VSOLAR
  Top 0.152: U5.1 39.66,78.44 37.42,80.67 36.42,80.67 36.3,80.8 R9.1
  pour Top (isolate 0.2, no thermals): 35.3,80.9 35.3,85 37.2,85 37.2,80.9
XSHUT
  Top 0.2: R16.1 29,78.9 U1.8

### Text on the board
tPlace: OreSat Solar Module v1 | 2017/01/23
bPlace: 2017/01/23 | OreSat Solar Module v1 | 8 | DEBUG | 1
tDimensions: x6 | Internal radii = 1 mm / External radii = 2 mm